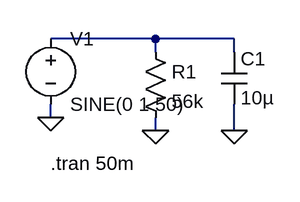
[diagram p0: schematic Preamp_I_o_sim.asc]
Preamp_I_o_sim.asc, the LTspice schematic file:
Version 4
SHEET 1 880 680
WIRE 160 128 32 128
WIRE 256 128 160 128
WIRE 160 144 160 128
WIRE 256 144 256 128
WIRE 32 224 32 208
WIRE 160 240 160 224
WIRE 256 240 256 208
FLAG 32 224 0
FLAG 160 240 0
FLAG 256 240 0
SYMBOL voltage 32 112 R0
WINDOW 123 0 0 Left 0
WINDOW 39 0 0 Left 0
SYMATTR InstName V1
SYMATTR Value SINE(0 1 50)
SYMBOL res 144 128 R0
SYMATTR InstName R1
SYMATTR Value 56k
SYMBOL cap 240 144 R0
SYMATTR InstName C1
SYMATTR Value 10µ
TEXT 32 280 Left 2 !.tran 50m

The netlist it stands for:
* Preamp_I_o_sim.asc
V1 N001 0 SINE(0 1 50)
R1 N001 0 56k
C1 N001 0 10µ
.tran 50m
.backanno
.end